# Altium schematic sheet power_input_SCH1.SchDoc
size B; Organization: CWRUbotix; Address1: 10900 Euclid Avenue; Address2: Cleveland, OH 44106; Address3: USA
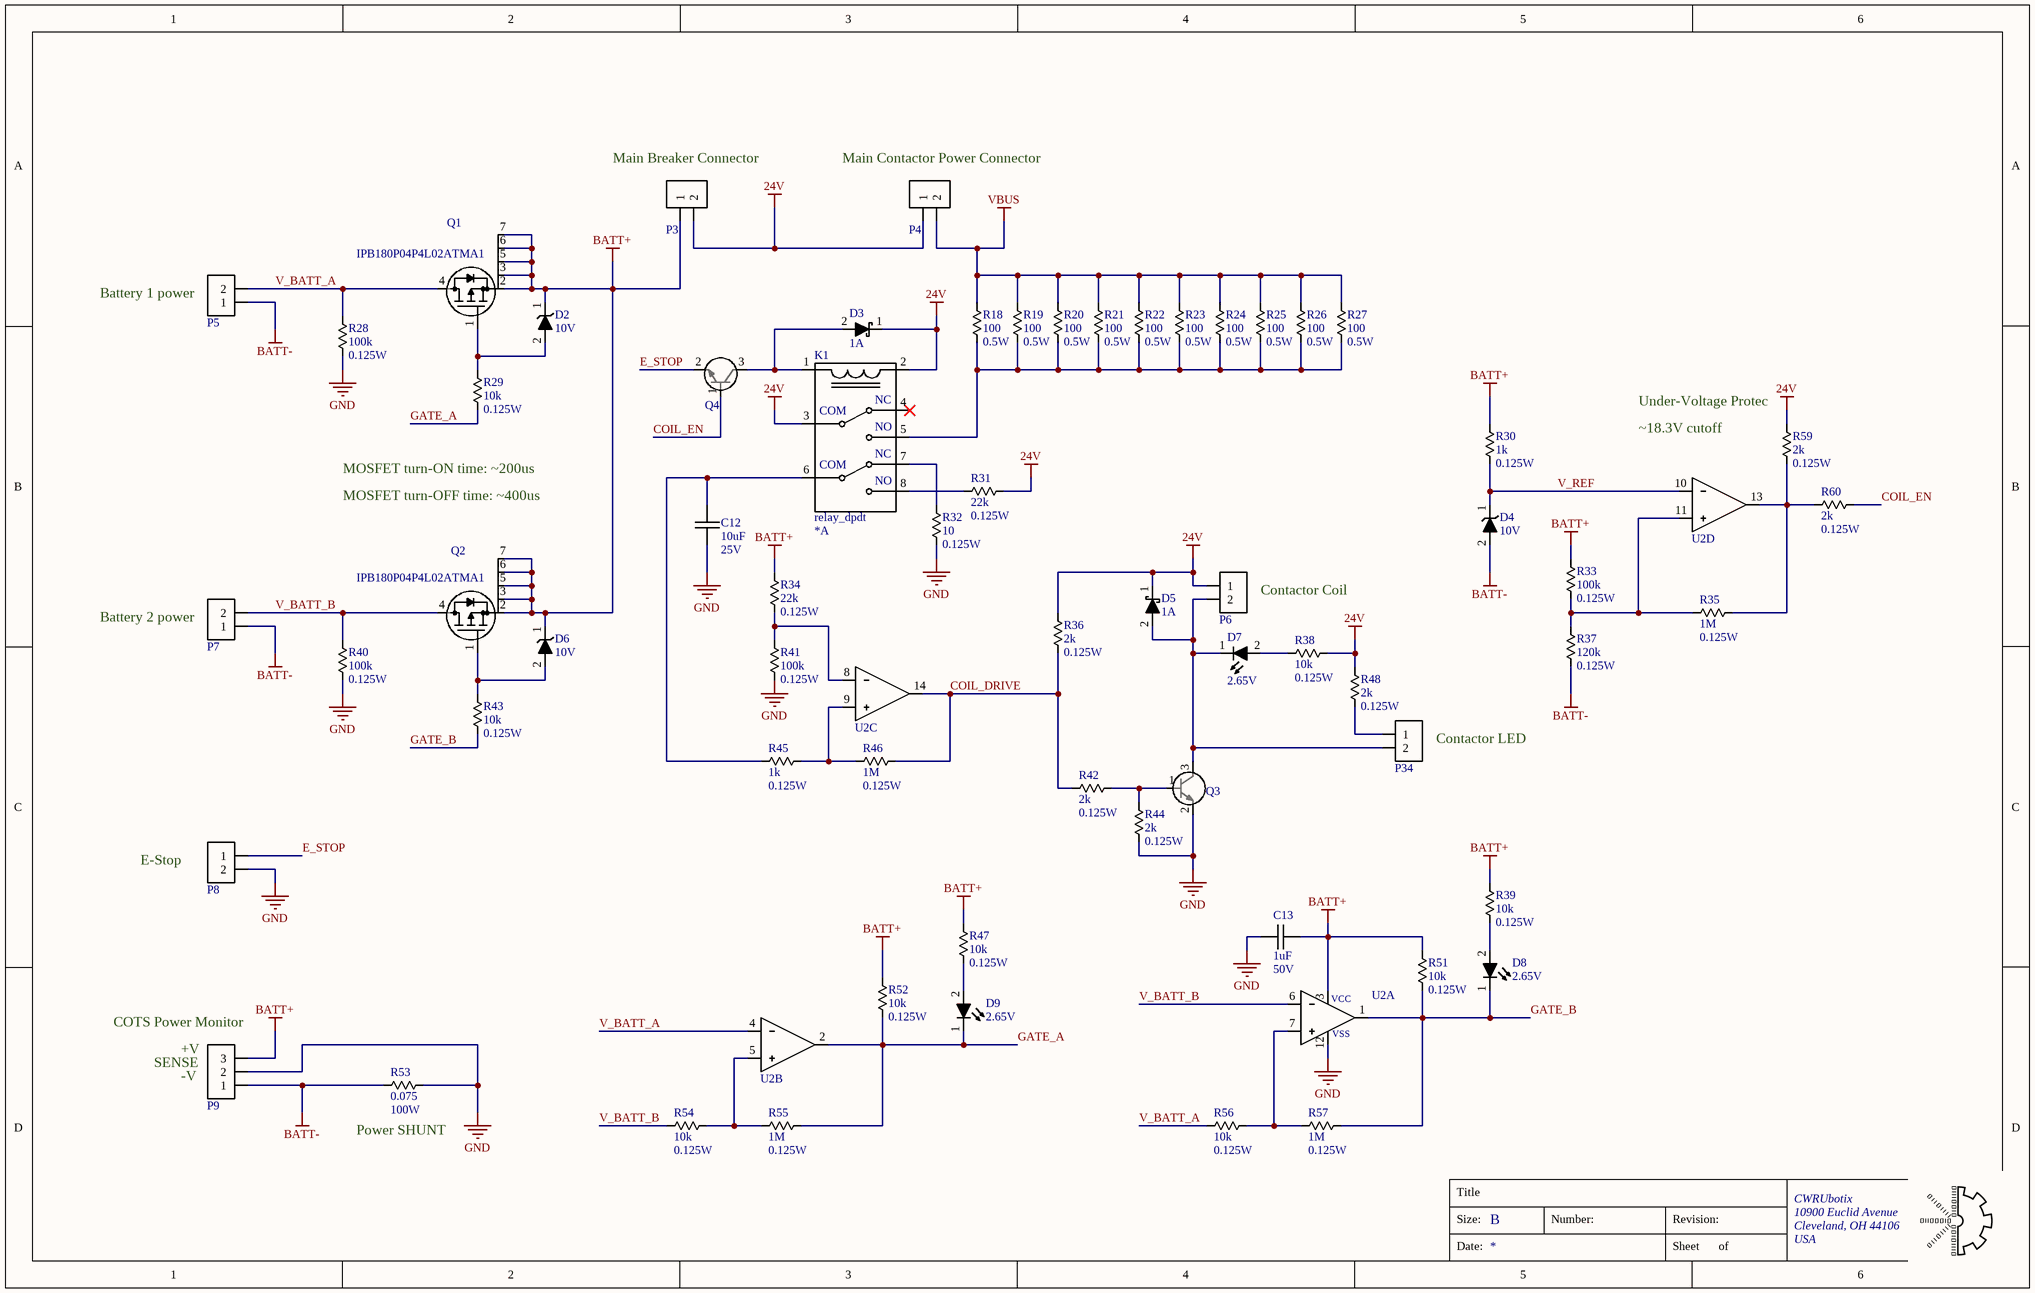
[diagram p0: power_input_SCH1.SchDoc]

## Parts
C12  Capacitance: 10uF  Voltage Rating: 25V  [chip_1206]  (hidden comment: cap_single_np)
C13  Capacitance: 1uF  Voltage Rating: 50V  [chip_0805]  (hidden comment: cap_single_np)
D2  Reverse Breakdown Voltage: 10V  [sod323_0]  (hidden comment: diode_1)
D3  Current Rating: 1A  [sod123_0]  (hidden comment: diode_2)
D4  Reverse Breakdown Voltage: 10V  [sod323_0]  (hidden comment: diode_1)
D5  Current Rating: 1A  [sod123_0]  (hidden comment: diode_2)
D6  Reverse Breakdown Voltage: 10V  [sod323_0]  (hidden comment: diode_1)
D7  Forward Voltage: 2.65V  [chip_0603]  (hidden comment: diode_4)
D8  Forward Voltage: 2.65V  [chip_0603]  (hidden comment: diode_4)
D9  Forward Voltage: 2.65V  [chip_0603]  (hidden comment: diode_4)
K1  relay_dpdt  Contact Current Rating: *A  [RELAY_SHRACK_RT2]
P3  conn-2x1_0  [BARR_0.5IN_2x1_0]  (value not drawn)
P4  conn-2x1_0  [BARR_0.5IN_2x1_0]  (value not drawn)
P5  conn-2x1_0  [BARR_0.5IN_2x1_0]  (value not drawn)
P6  conn-2x1_0  [JST_PHR_2_0]  (value not drawn)
P7  conn-2x1_0  [BARR_0.5IN_2x1_0]  (value not drawn)
P8  conn-2x1_0  [JST_PHR_2_0]  (value not drawn)
P9  conn-3x1_0  [JST_PHR_3_0]  (value not drawn)
P34  conn-2x1_0  [JST_PHR_2_0]  (value not drawn)
Q1  Manufacturer PN: IPB180P04P4L02ATMA1  [PG-TO263-7-3]  (hidden comment: p-mosfet_4)
Q2  Manufacturer PN: IPB180P04P4L02ATMA1  [PG-TO263-7-3]  (hidden comment: p-mosfet_4)
Q3  npn-bjt_0  [sot-23-3]  (value not drawn)
Q4  npn-bjt_0  [sot-23-3]  (value not drawn)
R18  Resistance: 100  Power Rating: 0.5W  [chip_1206]  (hidden comment: res_single)
R19  Resistance: 100  Power Rating: 0.5W  [chip_1206]  (hidden comment: res_single)
R20  Resistance: 100  Power Rating: 0.5W  [chip_1206]  (hidden comment: res_single)
R21  Resistance: 100  Power Rating: 0.5W  [chip_1206]  (hidden comment: res_single)
R22  Resistance: 100  Power Rating: 0.5W  [chip_1206]  (hidden comment: res_single)
R23  Resistance: 100  Power Rating: 0.5W  [chip_1206]  (hidden comment: res_single)
R24  Resistance: 100  Power Rating: 0.5W  [chip_1206]  (hidden comment: res_single)
R25  Resistance: 100  Power Rating: 0.5W  [chip_1206]  (hidden comment: res_single)
R26  Resistance: 100  Power Rating: 0.5W  [chip_1206]  (hidden comment: res_single)
R27  Resistance: 100  Power Rating: 0.5W  [chip_1206]  (hidden comment: res_single)
R28  Resistance: 100k  Power Rating: 0.125W  [chip_0805]  (hidden comment: res_single)
R29  Resistance: 10k  Power Rating: 0.125W  [chip_0805]  (hidden comment: res_single)
R30  Resistance: 1k  Power Rating: 0.125W  [chip_0805]  (hidden comment: res_single)
R31  Resistance: 22k  Power Rating: 0.125W  [chip_0805]  (hidden comment: res_single)
R32  Resistance: 10  Power Rating: 0.125W  [chip_0805]  (hidden comment: res_single)
R33  Resistance: 100k  Power Rating: 0.125W  [chip_0805]  (hidden comment: res_single)
R34  Resistance: 22k  Power Rating: 0.125W  [chip_0805]  (hidden comment: res_single)
R35  Resistance: 1M  Power Rating: 0.125W  [chip_0805]  (hidden comment: res_single)
R36  Resistance: 2k  Power Rating: 0.125W  [chip_0805]  (hidden comment: res_single)
R37  Resistance: 120k  Power Rating: 0.125W  [chip_0805]  (hidden comment: res_single)
R38  Resistance: 10k  Power Rating: 0.125W  [chip_0805]  (hidden comment: res_single)
R39  Resistance: 10k  Power Rating: 0.125W  [chip_0805]  (hidden comment: res_single)
R40  Resistance: 100k  Power Rating: 0.125W  [chip_0805]  (hidden comment: res_single)
R41  Resistance: 100k  Power Rating: 0.125W  [chip_0805]  (hidden comment: res_single)
R42  Resistance: 2k  Power Rating: 0.125W  [chip_0805]  (hidden comment: res_single)
R43  Resistance: 10k  Power Rating: 0.125W  [chip_0805]  (hidden comment: res_single)
R44  Resistance: 2k  Power Rating: 0.125W  [chip_0805]  (hidden comment: res_single)
R45  Resistance: 1k  Power Rating: 0.125W  [chip_0805]  (hidden comment: res_single)
R46  Resistance: 1M  Power Rating: 0.125W  [chip_0805]  (hidden comment: res_single)
R47  Resistance: 10k  Power Rating: 0.125W  [chip_0805]  (hidden comment: res_single)
R48  Resistance: 2k  Power Rating: 0.125W  [chip_0805]  (hidden comment: res_single)
R51  Resistance: 10k  Power Rating: 0.125W  [chip_0805]  (hidden comment: res_single)
R52  Resistance: 10k  Power Rating: 0.125W  [chip_0805]  (hidden comment: res_single)
R53  Resistance: 0.075  Power Rating: 100W  [TO-247-2-H]  (hidden comment: res_single)
R54  Resistance: 10k  Power Rating: 0.125W  [chip_0805]  (hidden comment: res_single)
R55  Resistance: 1M  Power Rating: 0.125W  [chip_0805]  (hidden comment: res_single)
R56  Resistance: 10k  Power Rating: 0.125W  [chip_0805]  (hidden comment: res_single)
R57  Resistance: 1M  Power Rating: 0.125W  [chip_0805]  (hidden comment: res_single)
R59  Resistance: 2k  Power Rating: 0.125W  [chip_0805]  (hidden comment: res_single)
R60  Resistance: 2k  Power Rating: 0.125W  [chip_0805]  (hidden comment: res_single)
U2  LM339  [so-14]  (value not drawn)  (parts A,B,C,D of 4)

## Nets
24V: D3.1 D5.1 K1.2 K1.3(COM) P3.2 P4.1 P6.1 R31.2 R36.2 R38.2 R48.2 R59.2
BATT+: C13.2 D2.1 D6.1 P3.1 P9.3 Q1.2(S) Q1.3(S) Q1.5(S) Q1.6(S) Q1.7(S) Q2.2(S) Q2.3(S) Q2.5(S) Q2.6(S) Q2.7(S) R30.2 R33.1 R34.1 R39.1 R47.2 R51.1 R52.1 U2.3
BATT-: D4.2 P5.1 P7.1 P9.1 R37.2 R53.1
GND: C12.2 C13.1 P8.2 P9.2 Q3.2(E) R28.1 R32.2 R40.2 R41.2 R44.2 R53.2 U2.12
VBUS: P4.2 R18.2 R19.2 R20.2 R21.2 R22.2 R23.2 R24.2 R25.2 R26.2 R27.2
COIL_DRIVE: R36.1 R42.1 R46.2 U2.14
COIL_EN: Q4.1(B) R60.1
E_STOP: P8.1 Q4.2(E)
GATE_A: D9.1 R29.2 R52.2 R55.2 U2.2
GATE_B: D8.1 R43.2 R51.2 R57.2 U2.1
V_BATT_A: P5.2 Q1.4(D) R28.2 R56.1 U2.4
V_BATT_B: P7.2 Q2.4(D) R40.1 R54.1 U2.6
V_REF: D4.1 R30.1 U2.10
NetC12_1: C12.1 K1.6(COM) R45.1
NetD2_2: D2.2 Q1.1(G) R29.1
NetD3_2: D3.2 K1.1 Q4.3(C)
NetD5_2: D5.2 D7.1 P6.2 P34.2 Q3.3(C)
NetD6_2: D6.2 Q2.1(G) R43.1
NetD7_2: D7.2 R38.1
NetD8_2: D8.2 R39.2
NetD9_2: D9.2 R47.1
NetK1_5: K1.5(NO) R18.1 R19.1 R20.1 R21.1 R22.1 R23.1 R24.1 R25.1 R26.1 R27.1
NetK1_7: K1.7(NC) R32.1
NetK1_8: K1.8(NO) R31.1
NetP34_1: P34.1 R48.1
NetQ3_1: Q3.1(B) R42.2 R44.1
NetR33_2: R33.2 R35.1 R37.1 U2.11
NetR34_2: R34.2 R41.1 U2.8
NetR35_2: R35.2 R59.1 R60.2 U2.13
NetR45_2: R45.2 R46.1 U2.9
NetR54_2: R54.2 R55.1 U2.5
NetR56_2: R56.2 R57.1 U2.7

Not connected (* = marked no-connect by the designer): K1 4(NC)*

## Notes on the sheet
- (near P3) Main Breaker Connector
- (near P4) Main Contactor Power Connector
- (near P5) Battery 1 power
- (near R59) Under-Voltage Protec
- ~18.3V cutoff
- MOSFET turn-ON time: ~200us
- MOSFET turn-OFF time: ~400us
- (near P7) Battery 2 power
- Contactor Coil
- (near P34) Contactor LED
- (near P8) E-Stop
- (near P9) COTS Power Monitor
- (near P9) SENSE
- (near P9) +V
- (near P9) -V
- (near R53) Power SHUNT
- Title
- Size:
- B
- Number:
- Revision:
- Date:
- Sheet
- of
- (in symbol ANLG-00006, part A) VCC; VSS

## Library data of the parts
C12 = CAP-00539: CAP, 10uF, ±10%, 25V, X7R, 1206; Manufacturer: Samsung; Manufacturer PN: CL31B106KAHNNNE; Tolerance: ±10%; Part Number: CAP-00539; Type: X7R
C13 = CAP-00109: CAP, 1uF, 10%, 50V, X7R, 0805; Manufacturer: Murata; Manufacturer PN: GRM21BR71H105KA12L; Tolerance: 10%; Part Number: CAP-00109; Type: X7R
D2 D4 D6 = DIO-00019: Dio Zen, 10V, 2%, 200mW, SOD-323; Manufacturer: ON Semi; Manufacturer PN: MM3Z10VST1G; Forward Voltage: 900mV; Type: Zener; Part Number: DIO-00019; Tolerance: 2%; Power Rating: 200mW
D3 D5 = DIO-00001: Dio Shtky, 1A, 0.55V, 40V, SOD-123; Manufacturer: ON Semi; Manufacturer PN: MBR140SFT1G; Forward Voltage: 550mV; Type: Schottky; Reverse Breakdown Voltage: 40V; Part Number: DIO-00001
D7-D9 = DIO-00050: LED, Green, 0603, Low current, HELI2 Series; Manufacturer: Kingbright; Manufacturer PN: APT1608LZGCK; Reverse Breakdown Voltage: 5V; Current Rating: 30mA; Power Rating: 120mW; Type: LED; Part Number: DIO-00050; Cost: 0.58
K1 = MISC-00005: Relay 24V, 8A, DPDT; Manufacturer: TE Connectivity; Manufacturer PN: RTE24024; Latching: *; Turn-on Voltage: *; Turn-off Voltage: *; Part Number: MISC-00005; Cost: 3.12; Weight: 13
P3-P5 P7 = CONN-00001: Barrier Blk, 2 Pos, 50 A; Manufacturer: Molex; Manufacturer PN: 389690002; Positions per level: 2; Levels: 1; Current: 50; Part Number: CONN-00001; Type: Barrier Block; Cost: 1.68; Weight: 7.5
P6 P8 P34 = CONN-00048: JST PH 2x1, THT, 2.00mm Pitch; Manufacturer PN: B2B-PH-K; Positions per level: 2; Levels: 1; Part Number: CONN-00048; Type: Header; Manufacturer: JST; Cost: 0.19
P9 = CONN-00047: JST PH 3x1, THT, 2.00mm Pitch; Manufacturer PN: B3B-PH-K; Positions per level: 3; Levels: 1; Part Number: CONN-00047; Type: Header; Manufacturer: JST; Cost: 0.19
Q1 Q2 = XSTR-00027: XSTR PFET, 180A, 40V, Vgs 1.7V, PG-TO263-7-3; Manufacturer: Infineon; Max Power: 150W; Max Current: 180A; Max Voltage: 40V; Type: PFET; Part Number: XSTR-00027; Vgs/Vce: 1.7V; Cost: 2.99
Q3 Q4 = XSTR-00021: XSTR NPN, 2A, 100V, Vce 0.15V, SOT-23; Manufacturer: ON Semi; Manufacturer PN: NSS1C201LT1G; Max Power: 490mW; Max Current: 2A; Max Voltage: 100V; Type: NPN; Part Number: XSTR-00021; Vgs/Vce: 0.15V; Cost: 0.48
R18-R27 = RES-00595: RES SMD 100 OHM 1% 1/2W 1206; Tolerance: 1%; Part Number: RES-00595
R28 R33 R40 R41 = RES-00302: RES SMD 100K OHM 1% 1/8W 0805; Manufacturer: Rohm Semiconductor; Manufacturer PN: KTR10EZPF1003; Tolerance: 1%; Part Number: RES-00302
R29 R38 R39 R43 R47 R51 R52 R54 R56 = RES-00307: RES SMD 10K OHM 1% 1/8W 0805; Manufacturer: Rohm Semiconductor; Manufacturer PN: KTR10EZPF1002; Tolerance: 1%; Part Number: RES-00307
R30 R45 = RES-00361: RES SMD 1K OHM 1% 1/8W 0805; Manufacturer: Rohm Semiconductor; Manufacturer PN: KTR10EZPF1001; Tolerance: 1%; Part Number: RES-00361
R31 R34 = RES-00391: RES SMD 22K OHM 1% 1/8W 0805; Manufacturer: Rohm Semiconductor; Manufacturer PN: KTR10EZPF2202; Tolerance: 1%; Part Number: RES-00391
R32 = RES-00117: RES SMD 10 OHM 1% 1/8W 0805; Manufacturer: Rohm Semiconductor; Manufacturer PN: KTR10EZPF10R0; Tolerance: 1%; Part Number: RES-00117
R35 R46 R55 R57 = RES-00363: RES SMD 1M OHM 1% 1/8W 0805; Manufacturer: Rohm Semiconductor; Manufacturer PN: KTR10EZPF1004; Tolerance: 1%; Part Number: RES-00363
R36 R42 R44 R48 R59 R60 = RES-00414: RES SMD 2K OHM 1% 1/8W 0805; Manufacturer: Rohm Semiconductor; Manufacturer PN: KTR10EZPF2001; Tolerance: 1%; Part Number: RES-00414
R37 = RES-00319: RES SMD 120K OHM 1% 1/8W 0805; Manufacturer: Rohm Semiconductor; Manufacturer PN: KTR10EZPF1203; Tolerance: 1%; Part Number: RES-00319
R53 = RES-00688: RES THT 0.075 OHM 1% 100W TO-247-2 Board Mounted; Manufacturer: Caddock; Manufacturer PN: MP9100-0.075-1%; Tolerance: 1%; Part Number: RES-00688
U2 = ANLG-00006: Comp, Quad, LM339; Manufacturer: TI; Part Number: ANLG-00006; Manufacturer PN: LM339